# EAGLE design PGTN_daisy1_main_8cvin_2cvout (EAGLE 9.6.0)
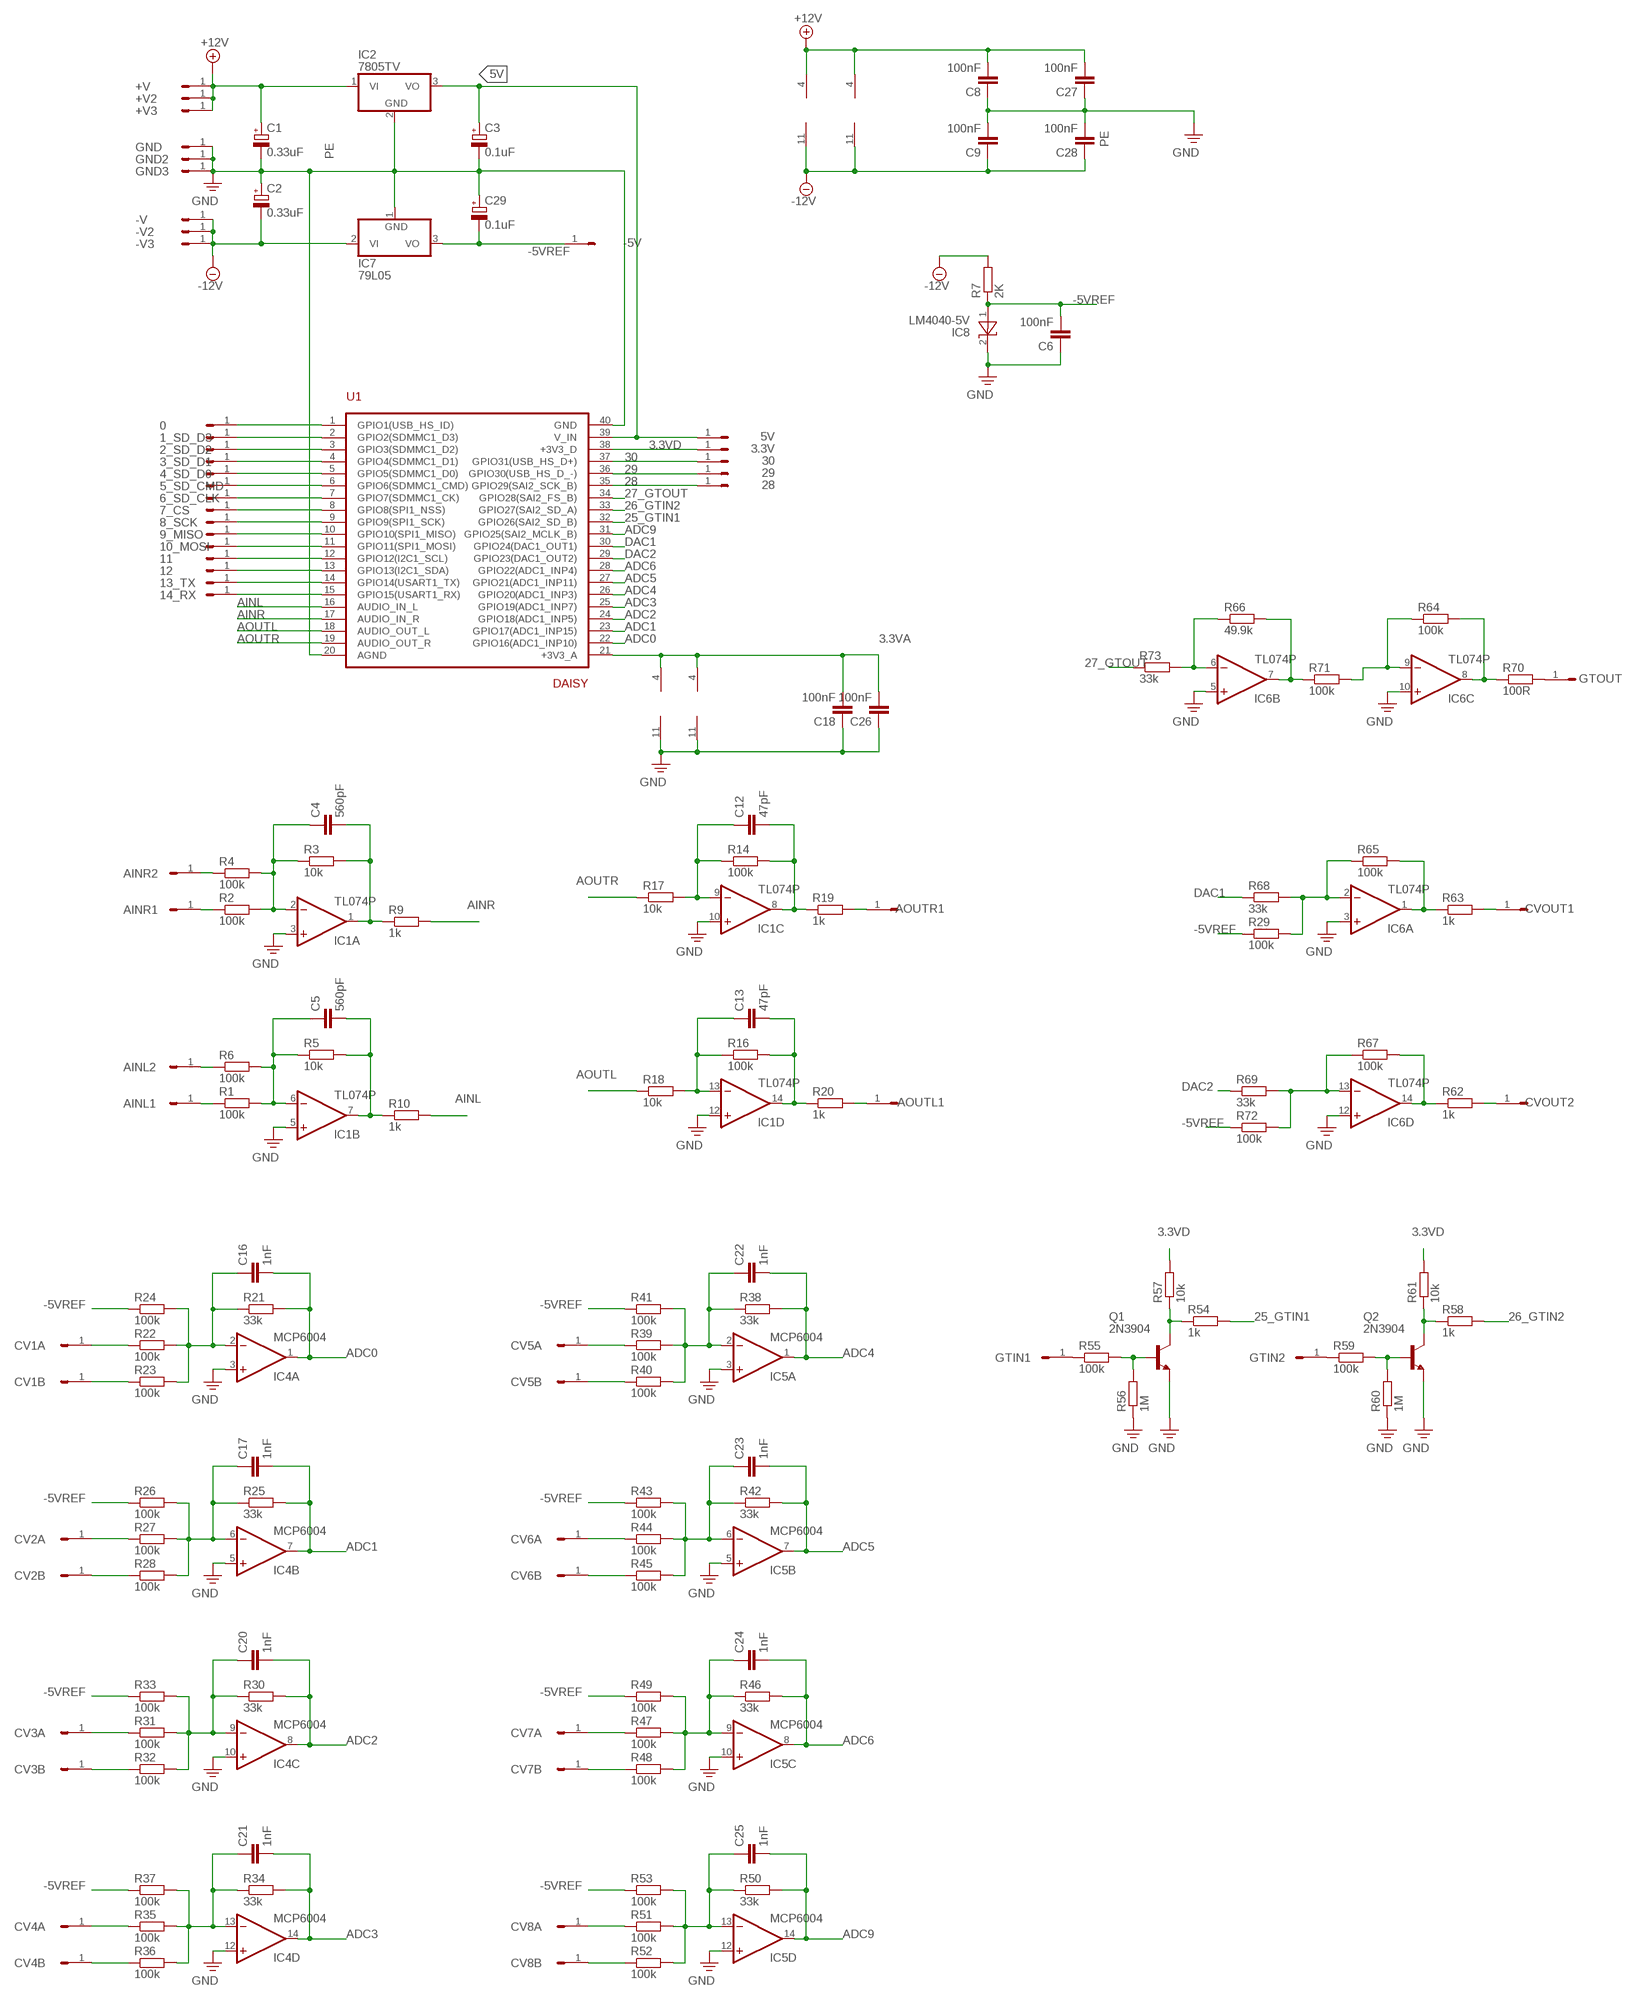
[diagram p0: schematic, sheet 1]

## Parts
0  HEADER/MALE/01  [HEADER/MALE/01]
1_SD_D3  HEADER/MALE/01  [HEADER/MALE/01]
2_SD_D2  HEADER/MALE/01  [HEADER/MALE/01]
3.3V  HEADER/MALE/01  [HEADER/MALE/01]
3_SD_D1  HEADER/MALE/01  [HEADER/MALE/01]
4_SD_D0  HEADER/MALE/01  [HEADER/MALE/01]
5_SD_CMD  HEADER/MALE/01  [HEADER/MALE/01]
5V  HEADER/MALE/01  [HEADER/MALE/01]
6_SD_CLK  HEADER/MALE/01  [HEADER/MALE/01]
7_CS  HEADER/MALE/01  [HEADER/MALE/01]
8_SCK  HEADER/MALE/01  [HEADER/MALE/01]
9_MISO  HEADER/MALE/01  [HEADER/MALE/01]
10_MOSI  HEADER/MALE/01  [HEADER/MALE/01]
11  HEADER/MALE/01  [HEADER/MALE/01]
12  HEADER/MALE/01  [HEADER/MALE/01]
13_TX  HEADER/MALE/01  [HEADER/MALE/01]
14_RX  HEADER/MALE/01  [HEADER/MALE/01]
28  HEADER/MALE/01  [HEADER/MALE/01]
29  HEADER/MALE/01  [HEADER/MALE/01]
30  HEADER/MALE/01  [HEADER/MALE/01]
+V  HEADER/MALE/01  [HEADER/MALE/01]
+V2  HEADER/MALE/01  [HEADER/MALE/01]
+V3  HEADER/MALE/01  [HEADER/MALE/01]
-5V  HEADER/MALE/01  [HEADER/MALE/01]
-V  HEADER/MALE/01  [HEADER/MALE/01]
-V2  HEADER/MALE/01  [HEADER/MALE/01]
-V3  HEADER/MALE/01  [HEADER/MALE/01]
AINL1  HEADER/MALE/01  [HEADER/MALE/01]
AINL2  HEADER/MALE/01  [HEADER/MALE/01]
AINR1  HEADER/MALE/01  [HEADER/MALE/01]
AINR2  HEADER/MALE/01  [HEADER/MALE/01]
AOUTL1  HEADER/MALE/01  [HEADER/MALE/01]
AOUTR1  HEADER/MALE/01  [HEADER/MALE/01]
C1  0.33uF  CAPACITOR/POLARIZEDE2.5-6  [E2,5-6]
C2  0.33uF  CAPACITOR/POLARIZEDE2.5-6  [E2,5-6]
C3  0.1uF  CAPACITOR/POLARIZEDE2.5-6  [E2,5-6]
C4  560pF  CAPACITORCERAMICDISC/5  [CERAMICDISC/5]
C5  560pF  CAPACITORCERAMICDISC/5  [CERAMICDISC/5]
C6  100nF  CAPACITORCERAMICDISC/5  [CERAMICDISC/5]
C8  100nF  CAPACITORCERAMICDISC/5  [CERAMICDISC/5]
C9  100nF  CAPACITORCERAMICDISC/5  [CERAMICDISC/5]
C12  47pF  CAPACITORCERAMICDISC/5  [CERAMICDISC/5]
C13  47pF  CAPACITORCERAMICDISC/5  [CERAMICDISC/5]
C16  1nF  CAPACITORCERAMICDISC/5  [CERAMICDISC/5]
C17  1nF  CAPACITORCERAMICDISC/5  [CERAMICDISC/5]
C18  100nF  CAPACITORCERAMICDISC/5  [CERAMICDISC/5]
C20  1nF  CAPACITORCERAMICDISC/5  [CERAMICDISC/5]
C21  1nF  CAPACITORCERAMICDISC/5  [CERAMICDISC/5]
C22  1nF  CAPACITORCERAMICDISC/5  [CERAMICDISC/5]
C23  1nF  CAPACITORCERAMICDISC/5  [CERAMICDISC/5]
C24  1nF  CAPACITORCERAMICDISC/5  [CERAMICDISC/5]
C25  1nF  CAPACITORCERAMICDISC/5  [CERAMICDISC/5]
C26  100nF  CAPACITORCERAMICDISC/5  [CERAMICDISC/5]
C27  100nF  CAPACITORCERAMICDISC/5  [CERAMICDISC/5]
C28  100nF  CAPACITORCERAMICDISC/5  [CERAMICDISC/5]
C29  0.1uF  CAPACITOR/POLARIZEDE2.5-6  [E2,5-6]
CV1A  HEADER/MALE/01  [HEADER/MALE/01]
CV1B  HEADER/MALE/01  [HEADER/MALE/01]
CV2A  HEADER/MALE/01  [HEADER/MALE/01]
CV2B  HEADER/MALE/01  [HEADER/MALE/01]
CV3A  HEADER/MALE/01  [HEADER/MALE/01]
CV3B  HEADER/MALE/01  [HEADER/MALE/01]
CV4A  HEADER/MALE/01  [HEADER/MALE/01]
CV4B  HEADER/MALE/01  [HEADER/MALE/01]
CV5A  HEADER/MALE/01  [HEADER/MALE/01]
CV5B  HEADER/MALE/01  [HEADER/MALE/01]
CV6A  HEADER/MALE/01  [HEADER/MALE/01]
CV6B  HEADER/MALE/01  [HEADER/MALE/01]
CV7A  HEADER/MALE/01  [HEADER/MALE/01]
CV7B  HEADER/MALE/01  [HEADER/MALE/01]
CV8A  HEADER/MALE/01  [HEADER/MALE/01]
CV8B  HEADER/MALE/01  [HEADER/MALE/01]
CVOUT1  HEADER/MALE/01  [HEADER/MALE/01]
CVOUT2  HEADER/MALE/01  [HEADER/MALE/01]
GND  HEADER/MALE/01  [HEADER/MALE/01]
GND2  HEADER/MALE/01  [HEADER/MALE/01]
GND3  HEADER/MALE/01  [HEADER/MALE/01]
GTIN1  HEADER/MALE/01  [HEADER/MALE/01]
GTIN2  HEADER/MALE/01  [HEADER/MALE/01]
GTOUT  HEADER/MALE/01  [HEADER/MALE/01]
IC1  TL074P  [DIL14]
IC2  7805TV  [TO220V]
IC4  MCP6004  TL074P  [DIL14]
IC5  MCP6004  TL074P  [DIL14]
IC6  TL074P  [DIL14]
IC7  79L05  79L05Z  [TO92]
IC8  LM4040-5V  LM4040  [TO92]
Q1  2N3904  [TO92]
Q2  2N3904  [TO92]
R1  100k  RESISTORRESISTOR/UPRIGHT/7.5  [RESISTOR/7.5]
R2  100k  RESISTORRESISTOR/UPRIGHT/7.5  [RESISTOR/7.5]
R3  10k  RESISTORRESISTOR/UPRIGHT/7.5  [RESISTOR/7.5]
R4  100k  RESISTORRESISTOR/UPRIGHT/7.5  [RESISTOR/7.5]
R5  10k  RESISTORRESISTOR/UPRIGHT/7.5  [RESISTOR/7.5]
R6  100k  RESISTORRESISTOR/UPRIGHT/7.5  [RESISTOR/7.5]
R7  2K  RESISTORRESISTOR/UPRIGHT/7.5  [RESISTOR/7.5]
R9  1k  RESISTORRESISTOR/UPRIGHT/7.5  [RESISTOR/7.5]
R10  1k  RESISTORRESISTOR/UPRIGHT/7.5  [RESISTOR/7.5]
R14  100k  RESISTORRESISTOR/UPRIGHT/7.5  [RESISTOR/7.5]
R16  100k  RESISTORRESISTOR/UPRIGHT/7.5  [RESISTOR/7.5]
R17  10k  RESISTORRESISTOR/UPRIGHT/7.5  [RESISTOR/7.5]
R18  10k  RESISTORRESISTOR/UPRIGHT/7.5  [RESISTOR/7.5]
R19  1k  RESISTORRESISTOR/UPRIGHT/7.5  [RESISTOR/7.5]
R20  1k  RESISTORRESISTOR/UPRIGHT/7.5  [RESISTOR/7.5]
R21  33k  RESISTORRESISTOR/UPRIGHT/7.5  [RESISTOR/7.5]
R22  100k  RESISTORRESISTOR/UPRIGHT/7.5  [RESISTOR/7.5]
R23  100k  RESISTORRESISTOR/UPRIGHT/7.5  [RESISTOR/7.5]
R24  100k  RESISTORRESISTOR/UPRIGHT/7.5  [RESISTOR/7.5]
R25  33k  RESISTORRESISTOR/UPRIGHT/7.5  [RESISTOR/7.5]
R26  100k  RESISTORRESISTOR/UPRIGHT/7.5  [RESISTOR/7.5]
R27  100k  RESISTORRESISTOR/UPRIGHT/7.5  [RESISTOR/7.5]
R28  100k  RESISTORRESISTOR/UPRIGHT/7.5  [RESISTOR/7.5]
R29  100k  RESISTORRESISTOR/UPRIGHT/7.5  [RESISTOR/7.5]
R30  33k  RESISTORRESISTOR/UPRIGHT/7.5  [RESISTOR/7.5]
R31  100k  RESISTORRESISTOR/UPRIGHT/7.5  [RESISTOR/7.5]
R32  100k  RESISTORRESISTOR/UPRIGHT/7.5  [RESISTOR/7.5]
R33  100k  RESISTORRESISTOR/UPRIGHT/7.5  [RESISTOR/7.5]
R34  33k  RESISTORRESISTOR/UPRIGHT/7.5  [RESISTOR/7.5]
R35  100k  RESISTORRESISTOR/UPRIGHT/7.5  [RESISTOR/7.5]
R36  100k  RESISTORRESISTOR/UPRIGHT/7.5  [RESISTOR/7.5]
R37  100k  RESISTORRESISTOR/UPRIGHT/7.5  [RESISTOR/7.5]
R38  33k  RESISTORRESISTOR/UPRIGHT/7.5  [RESISTOR/7.5]
R39  100k  RESISTORRESISTOR/UPRIGHT/7.5  [RESISTOR/7.5]
R40  100k  RESISTORRESISTOR/UPRIGHT/7.5  [RESISTOR/7.5]
R41  100k  RESISTORRESISTOR/UPRIGHT/7.5  [RESISTOR/7.5]
R42  33k  RESISTORRESISTOR/UPRIGHT/7.5  [RESISTOR/7.5]
R43  100k  RESISTORRESISTOR/UPRIGHT/7.5  [RESISTOR/7.5]
R44  100k  RESISTORRESISTOR/UPRIGHT/7.5  [RESISTOR/7.5]
R45  100k  RESISTORRESISTOR/UPRIGHT/7.5  [RESISTOR/7.5]
R46  33k  RESISTORRESISTOR/UPRIGHT/7.5  [RESISTOR/7.5]
R47  100k  RESISTORRESISTOR/UPRIGHT/7.5  [RESISTOR/7.5]
R48  100k  RESISTORRESISTOR/UPRIGHT/7.5  [RESISTOR/7.5]
R49  100k  RESISTORRESISTOR/UPRIGHT/7.5  [RESISTOR/7.5]
R50  33k  RESISTORRESISTOR/UPRIGHT/7.5  [RESISTOR/7.5]
R51  100k  RESISTORRESISTOR/UPRIGHT/7.5  [RESISTOR/7.5]
R52  100k  RESISTORRESISTOR/UPRIGHT/7.5  [RESISTOR/7.5]
R53  100k  RESISTORRESISTOR/UPRIGHT/7.5  [RESISTOR/7.5]
R54  1k  RESISTORRESISTOR/UPRIGHT/7.5  [RESISTOR/7.5]
R55  100k  RESISTORRESISTOR/UPRIGHT/7.5  [RESISTOR/7.5]
R56  1M  RESISTORRESISTOR/UPRIGHT/7.5  [RESISTOR/7.5]
R57  10k  RESISTORRESISTOR/UPRIGHT/7.5  [RESISTOR/7.5]
R58  1k  RESISTORRESISTOR/UPRIGHT/7.5  [RESISTOR/7.5]
R59  100k  RESISTORRESISTOR/UPRIGHT/7.5  [RESISTOR/7.5]
R60  1M  RESISTORRESISTOR/UPRIGHT/7.5  [RESISTOR/7.5]
R61  10k  RESISTORRESISTOR/UPRIGHT/7.5  [RESISTOR/7.5]
R62  1k  RESISTORRESISTOR/UPRIGHT/7.5  [RESISTOR/7.5]
R63  1k  RESISTORRESISTOR/UPRIGHT/7.5  [RESISTOR/7.5]
R64  100k  RESISTORRESISTOR/UPRIGHT/7.5  [RESISTOR/7.5]
R65  100k  RESISTORRESISTOR/UPRIGHT/7.5  [RESISTOR/7.5]
R66  49.9k  RESISTORRESISTOR/UPRIGHT/7.5  [RESISTOR/7.5]
R67  100k  RESISTORRESISTOR/UPRIGHT/7.5  [RESISTOR/7.5]
R68  33k  RESISTORRESISTOR/UPRIGHT/7.5  [RESISTOR/7.5]
R69  33k  RESISTORRESISTOR/UPRIGHT/7.5  [RESISTOR/7.5]
R70  100R  RESISTORRESISTOR/UPRIGHT/7.5  [RESISTOR/7.5]
R71  100k  RESISTORRESISTOR/UPRIGHT/7.5  [RESISTOR/7.5]
R72  100k  RESISTORRESISTOR/UPRIGHT/7.5  [RESISTOR/7.5]
R73  33k  RESISTORRESISTOR/UPRIGHT/7.5  [RESISTOR/7.5]
U1  DAISY  ES_DAISY_SEED_REV4  [ES_DAISY_SEED]

## Nets
3.3VA: C18.2 C26.2 IC4.4(P:V+) IC5.4(P:V+) U1.21(+3V3_A)
3.3VD: 3.3V.1 R57.2 R61.2 U1.38(+3V3_D)
5V: 5V.1 C3.+ IC2.3(VO) U1.39(V_IN)
25_GTIN1: R54.2 U1.32(GPIO26(SAI2_SD_B))
26_GTIN2: R58.2 U1.33(GPIO27(SAI2_SD_A))
27_GTOUT: R73.1 U1.34(GPIO28(SAI2_FS_B))
28: 28.1 U1.35(GPIO29(SAI2_SCK_B))
29: 29.1 U1.36(GPIO30(USB_HS_D_-))
30: 30.1 U1.37(GPIO31(USB_HS_D+))
+12V: +V2.1 +V3.1 +V.1 C1.+ C8.2 C27.2 IC1.4(P:V+) IC2.1(VI) IC6.4(P:V+)
-5VREF: -5V.1 C6.2 C29.- IC7.3(VO) IC8.1(A) R7.1 R24.1 R26.1 R29.1 R33.1 R37.1 R41.1 R43.1 R49.1 R53.1 R72.1
-12V: -V2.1 -V3.1 -V.1 C2.- C9.1 C28.1 IC1.11(P:V-) IC6.11(P:V-) IC7.2(VI) R7.2
ADC0: C16.2 IC4.1(A:OUT) R21.2 U1.22(GPIO16(ADC1_INP10))
ADC1: C17.2 IC4.7(B:OUT) R25.2 U1.23(GPIO17(ADC1_INP15))
ADC2: C20.2 IC4.8(C:OUT) R30.2 U1.24(GPIO18(ADC1_INP5))
ADC3: C21.2 IC4.14(D:OUT) R34.2 U1.25(GPIO19(ADC1_INP7))
ADC4: C22.2 IC5.1(A:OUT) R38.2 U1.26(GPIO20(ADC1_INP3))
ADC5: C23.2 IC5.7(B:OUT) R42.2 U1.27(GPIO21(ADC1_INP11))
ADC6: C24.2 IC5.8(C:OUT) R46.2 U1.28(GPIO22(ADC1_INP4))
ADC9: C25.2 IC5.14(D:OUT) R50.2 U1.31(GPIO25(SAI2_MCLK_B))
AINL: R10.2 U1.16(AUDIO_IN_L)
AINR: R9.2 U1.17(AUDIO_IN_R)
AOUTL: R18.1 U1.18(AUDIO_OUT_L)
AOUTR: R17.1 U1.19(AUDIO_OUT_R)
DAC1: R68.1 U1.30(GPIO24(DAC1_OUT1))
DAC2: R69.1 U1.29(GPIO23(DAC1_OUT2))
N$1: CV2A.1 R27.1
N$2: AINR2.1 R4.1
N$3: AINL2.1 R6.1
N$4: C4.1 IC1.2(A:-IN) R2.2 R3.1 R4.2
N$5: C5.1 IC1.6(B:-IN) R1.2 R5.1 R6.2
N$6: AINR1.1 R2.1
N$7: AINL1.1 R1.1
N$9: C5.2 IC1.7(B:OUT) R5.2 R10.1
N$10: C4.2 IC1.1(A:OUT) R3.2 R9.1
N$11: AOUTR1.1 R19.2
N$12: C12.2 IC1.8(C:OUT) R14.2 R19.1
N$15: C13.2 IC1.14(D:OUT) R16.2 R20.1
N$17: C13.1 IC1.13(D:-IN) R16.1 R18.2
N$20: C12.1 IC1.9(C:-IN) R14.1 R17.2
N$21: AOUTL1.1 R20.2
N$22: CV1A.1 R22.1
N$23: 14_RX.1 U1.15(GPIO15(USART1_RX))
N$24: C16.1 IC4.2(A:-IN) R21.1 R22.2 R23.2 R24.2
N$25: GTIN2.1 R59.1
N$26: CV2B.1 R28.1
N$27: CV1B.1 R23.1
N$28: 13_TX.1 U1.14(GPIO14(USART1_TX))
N$29: C17.1 IC4.6(B:-IN) R25.1 R26.2 R27.2 R28.2
N$30: C21.1 IC4.13(D:-IN) R34.1 R35.2 R36.2 R37.2
N$31: CV4A.1 R35.1
N$32: CV4B.1 R36.1
N$33: 10_MOSI.1 U1.11(GPIO11(SPI1_MOSI))
N$34: CV3B.1 R32.1
N$35: CV3A.1 R31.1
N$36: C20.1 IC4.9(C:-IN) R30.1 R31.2 R32.2 R33.2
N$37: 9_MISO.1 U1.10(GPIO10(SPI1_MISO))
N$38: C22.1 IC5.2(A:-IN) R38.1 R39.2 R40.2 R41.2
N$39: 8_SCK.1 U1.9(GPIO9(SPI1_SCK))
N$40: CV5B.1 R40.1
N$41: CV5A.1 R39.1
N$42: 7_CS.1 U1.8(GPIO8(SPI1_NSS))
N$43: C23.1 IC5.6(B:-IN) R42.1 R43.2 R44.2 R45.2
N$44: CV6A.1 R44.1
N$45: CV6B.1 R45.1
N$46: C25.1 IC5.13(D:-IN) R50.1 R51.2 R52.2 R53.2
N$47: 6_SD_CLK.1 U1.7(GPIO7(SDMMC1_CK))
N$48: CV8A.1 R51.1
N$49: CV8B.1 R52.1
N$50: CV7B.1 R48.1
N$51: CV7A.1 R47.1
N$52: C24.1 IC5.9(C:-IN) R46.1 R47.2 R48.2 R49.2
N$53: 5_SD_CMD.1 U1.6(GPIO6(SDMMC1_CMD))
N$54: GTIN1.1 R55.1
N$55: Q1.2(B) R55.2 R56.2
N$56: Q1.1(C) R54.1 R57.1
N$57: CVOUT1.1 R63.2
N$58: Q2.2(B) R59.2 R60.2
N$59: Q2.1(C) R58.1 R61.1
N$60: CVOUT2.1 R62.2
N$61: 4_SD_D0.1 U1.5(GPIO5(SDMMC1_D0))
N$62: 3_SD_D1.1 U1.4(GPIO4(SDMMC1_D1))
N$63: 2_SD_D2.1 U1.3(GPIO3(SDMMC1_D2))
N$64: 1_SD_D3.1 U1.2(GPIO2(SDMMC1_D3))
N$65: 0.1 U1.1(GPIO1(USB_HS_ID))
N$66: 11.1 U1.12(GPIO12(I2C1_SCL))
N$67: 12.1 U1.13(GPIO13(I2C1_SDA))
N$69: IC6.1(A:OUT) R63.1 R65.2
N$70: IC6.9(C:-IN) R64.1 R71.2
N$71: IC6.14(D:OUT) R62.1 R67.2
N$72: IC6.6(B:-IN) R66.1 R73.2
N$73: IC6.13(D:-IN) R67.1 R69.2 R72.2
N$74: IC6.7(B:OUT) R66.2 R71.1
N$75: IC6.8(C:OUT) R64.2 R70.1
N$76: IC6.2(A:-IN) R29.2 R65.1 R68.2
N$78: GTOUT.1 R70.2
PE: C1.- C2.+ C3.- C6.1 C8.1 C9.2 C18.1 C26.1 C27.1 C28.2 C29.+ GND2.1 GND3.1 GND.1 IC1.3(A:+IN) IC1.5(B:+IN) IC1.10(C:+IN) IC1.12(D:+IN) IC2.2(GND) IC4.3(A:+IN) IC4.5(B:+IN) IC4.10(C:+IN) IC4.11(P:V-) IC4.12(D:+IN) IC5.3(A:+IN) IC5.5(B:+IN) IC5.10(C:+IN) IC5.11(P:V-) IC5.12(D:+IN) IC6.3(A:+IN) IC6.5(B:+IN) IC6.10(C:+IN) IC6.12(D:+IN) IC7.1(GND) IC8.2(C) Q1.3(E) Q2.3(E) R56.1 R60.1 U1.20(AGND) U1.40(GND) ; supply symbol labelled GND

## Library data of the parts
0 1_SD_D3 2_SD_D2 3.3V 3_SD_D1 4_SD_D0 5_SD_CMD 5V 6_SD_CLK 7_CS 8_SCK 9_MISO 10_MOSI 11 12 13_TX 14_RX 28-30 +V +V2 +V3 -5V -V -V2 -V3 AINL1 AINL2 AINR1 AINR2 AOUTL1 AOUTR1 CV1A CV1B CV2A CV2B CV3A CV3B CV4A CV4B CV5A CV5B CV6A CV6B CV7A CV7B CV8A CV8B CVOUT1 CVOUT2 GND GND2 GND3 GTIN1 GTIN2 GTOUT = connectors:HEADER/MALE/01; SPICEPREFIX: X
C1-C3 C29 = capacitors:CAPACITOR/POLARIZED: POLARIZED CAPACITOR, European symbol; SPICEPREFIX: C
C4-C6 C8 C9 C12 C13 C16-C18 C20-C28 = capacitors:CAPACITOR: CAPACITOR, European symbol
IC1 IC4-IC6 = ic_analogue:TL074: OP AMP
IC2 = ic_voltage_reg:78*: Positive VOLTAGE REGULATOR Source: http://cache.national.com/ds/LM/LM78L05.pdf http://www.fairchildsemi.com/ds/LM/LM7805.pdf
IC7 = linear:79*: Negative VOLTAGE REGULATOR
IC8 = ic_voltage_reg:LM4040
Q1 Q2 = transistors:2N3904: NPN Transistor
R1-R7 R9 R10 R14 R16-R73 = resistors:RESISTOR: RESISTOR, European symbol
U1 = Electrosmith-Boards:ES_DAISY_SEED_REV4; IPN: Daisy Seed

## Board
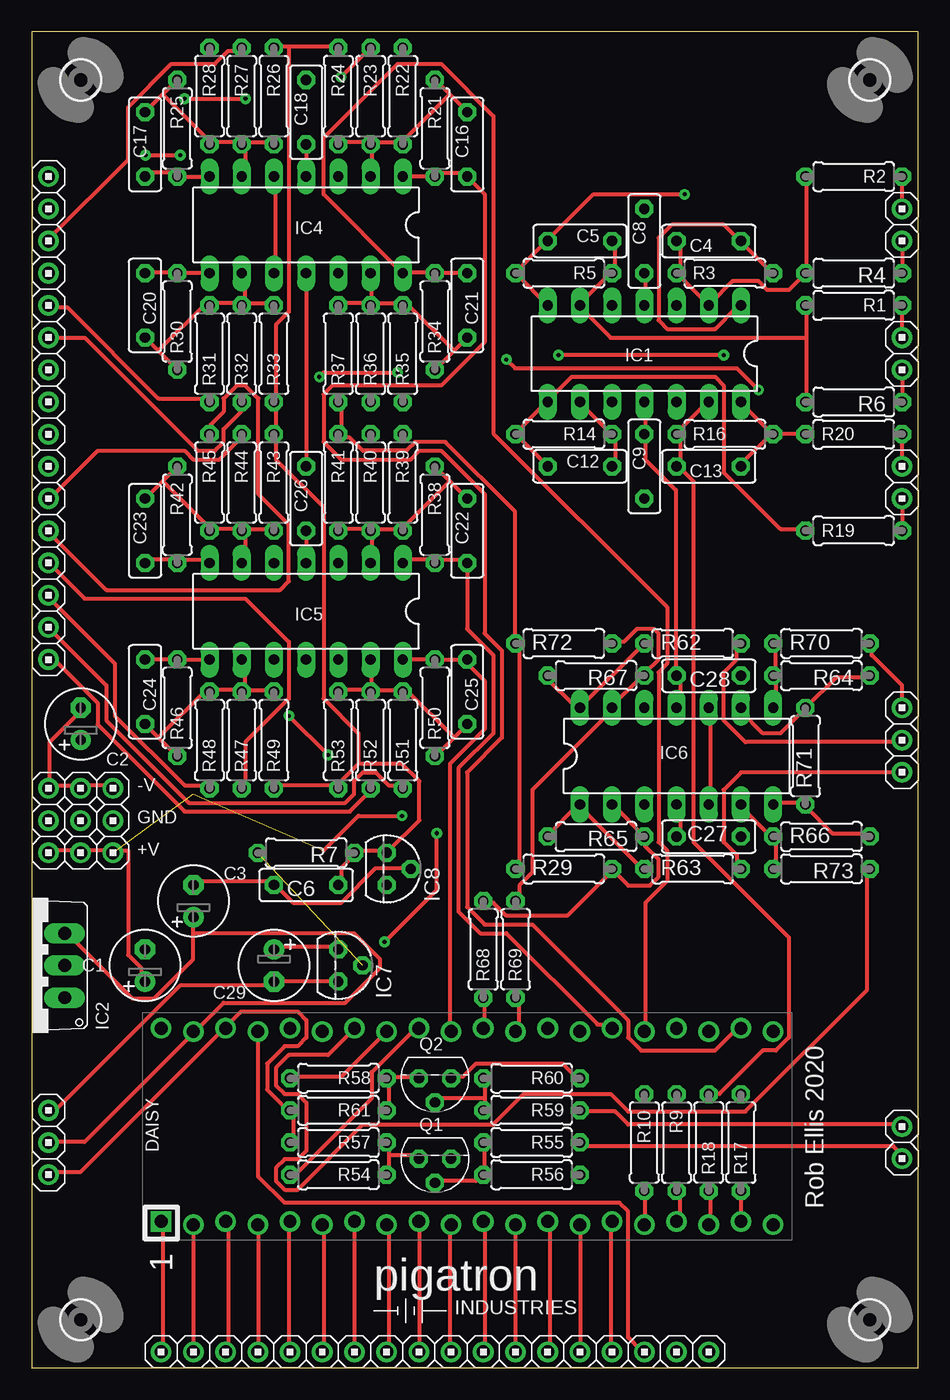
[diagram p1: board, top side]
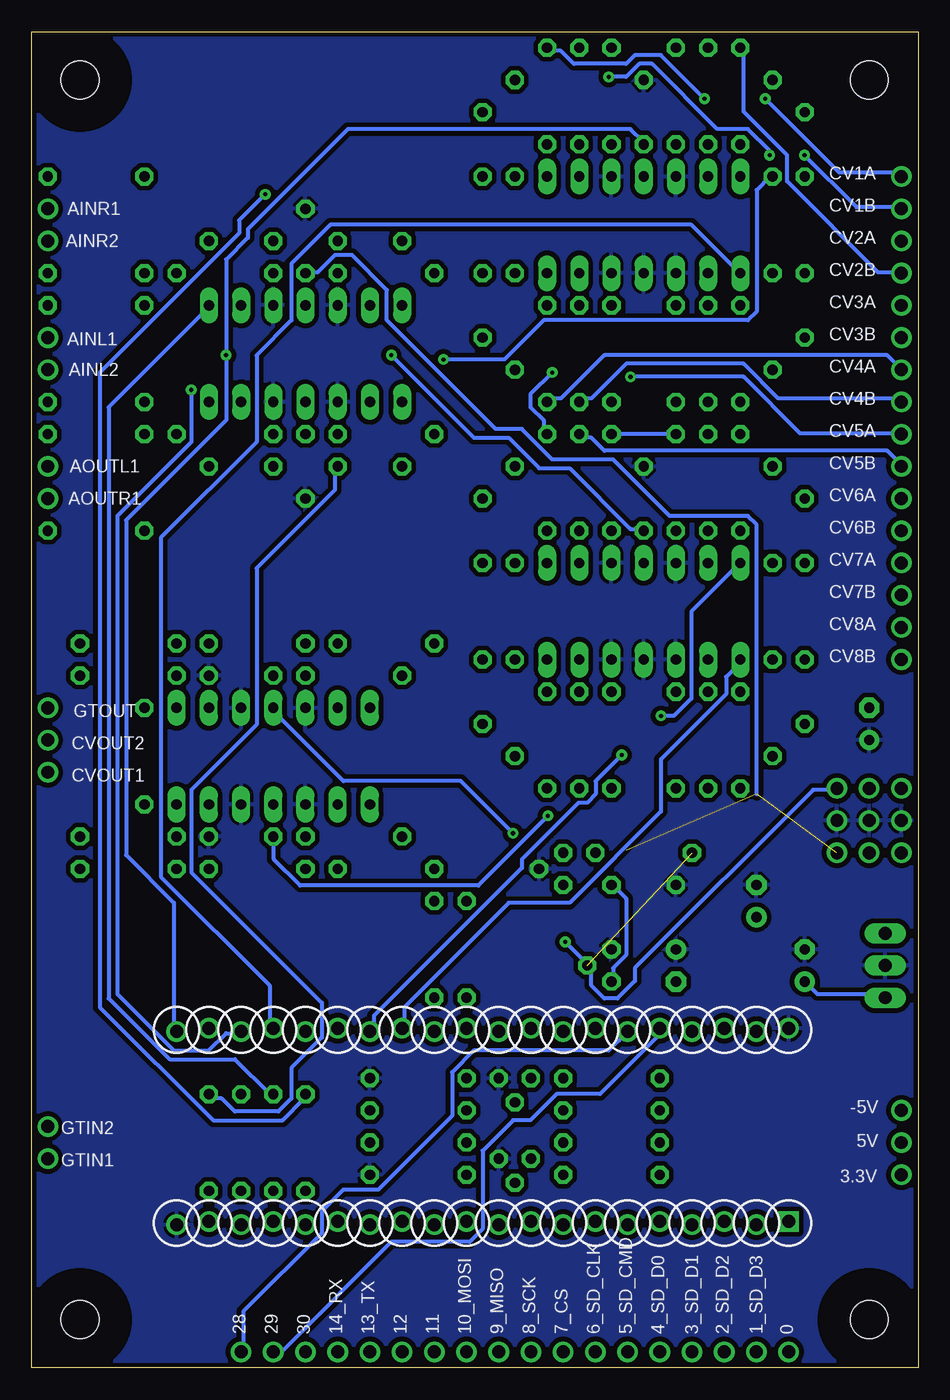
[diagram p2: board, bottom side, seen from below]

Size 69.9 x 105.4 mm. Coordinates in mm from the lower left corner, seen from the top.
Outline: 69.9,105.4 0,105.4 0,0 69.9,0 69.9,105.4
Copper layers (1*16): Top 0.0356mm / dielectric 1.5011mm / Bottom 0.0356mm
Design rules "pigatron": minimum track width 12mil, minimum drill 13mil, track to track 15mil, track to pad 10mil, pad to pad 10mil, via to via 10mil, smd to smd 6mil, copper to edge 15mil, drill to drill 10mil, minimum pad ring 12mil, minimum via ring 10mil, stop-mask expansion 4mil, vias tented up to drill 0mil, thermal gap 10mil

### Footprints (pad centres in the part's own frame; a part is rotated, then mirrored left to right if it is on the bottom)
HEADER/MALE/01 = drill 1.016: 1 0,0
E2,5-6 = drill 0.813 pad 1.6: + -1.27,0 | drill 0.813 pad 1.6 octagon: - 1.27,0
CERAMICDISC/5 = drill 0.813 octagon: 1 -2.54,0; 2 2.54,0
DIL14 = drill 0.813 long: 1 -7.62,-3.81; 2 -5.08,-3.81; 3 -2.54,-3.81; 4 0,-3.81; 5 2.54,-3.81; 6 5.08,-3.81; 7 7.62,-3.81; 8 7.62,3.81; 9 5.08,3.81; 10 2.54,3.81; 11 0,3.81; 12 -2.54,3.81; 13 -5.08,3.81; 14 -7.62,3.81
TO220V = drill 1.016 long: 1 -2.54,-2.54; 2 0,-2.54; 3 2.54,-2.54
TO92 = drill 0.813 octagon: 1 -1.27,0; 2 0,1.905; 3 1.27,0
TO92' = drill 0.813 octagon: 1 1.27,0; 2 0,1.905; 3 -1.27,0
RESISTOR/7.5 = drill 0.813 octagon: 1 -3.81,0; 2 3.81,0
ES_DAISY_SEED = drill 1.016 square: 1 -7.493,24.13 | drill 1.016: 2 -7.747,21.59; 3 -7.493,19.05; 4 -7.747,16.51; 5 -7.493,13.97; 6 -7.747,11.43; 7 -7.493,8.89; 8 -7.747,6.35; 9 -7.493,3.81; 10 -7.747,1.27; 11 -7.493,-1.27; 12 -7.747,-3.81; 13 -7.493,-6.35; 14 -7.747,-8.89; 15 -7.493,-11.43; 16 -7.747,-13.97; 17 -7.493,-16.51; 18 -7.747,-19.05; 19 -7.493,-21.59; 20 -7.747,-24.13; 21 7.493,-24.13; 22 7.747,-21.59; 23 7.493,-19.05; 24 7.747,-16.51; 25 7.493,-13.97; 26 7.747,-11.43; 27 7.493,-8.89; 28 7.747,-6.35; 29 7.493,-3.81; 30 7.747,-1.27; 31 7.493,1.27; 32 7.747,3.81; 33 7.493,6.35; 34 7.747,8.89; 35 7.493,11.43; 36 7.747,13.97; 37 7.493,16.51; 38 7.747,19.05; 39 7.493,21.59; 40 7.747,24.13
STANDOFF/3.0 = hole 3: 0,0

### Placement (x,y rotation side)
0  10.21,1.26 90 top
1_SD_D3  12.75,1.26 90 top
2_SD_D2  15.29,1.26 90 top
3.3V  1.32,15.23 270 top
3_SD_D1  17.83,1.26 90 top
4_SD_D0  20.37,1.26 90 top
5_SD_CMD  22.91,1.26 90 top
5V  1.32,17.77 180 top
6_SD_CLK  25.45,1.26 90 top
7_CS  27.99,1.26 90 top
8_SCK  30.53,1.26 90 top
9_MISO  33.07,1.26 90 top
10_MOSI  35.61,1.26 90 top
11  38.15,1.26 90 top
12  40.69,1.26 90 top
13_TX  43.23,1.26 90 top
14_RX  45.77,1.26 90 top
28  53.39,1.26 90 top
29  50.85,1.26 90 top
30  48.31,1.26 90 top
+V  6.4,40.63 0 top
+V2  3.86,40.63 180 top
+V3  1.32,40.63 180 top
-5V  1.32,20.31 0 top
-V  6.4,45.71 0 top
-V2  3.86,45.71 180 top
-V3  1.32,45.71 180 top
AINL1  68.63,81.27 180 top
AINL2  68.63,78.73 180 top
AINR1  68.63,91.43 180 top
AINR2  68.63,88.89 180 top
AOUTL1  68.63,71.11 180 top
AOUTR1  68.63,68.57 180 top
C1  8.94,31.74 90 top
C2  3.86,50.79 90 top
C3  12.75,36.82 90 top
C4  53.39,88.89 0 top
C5  43.23,88.89 180 top
C6  21.64,38.09 0 top
C8  48.31,88.89 270 top
C9  48.31,71.11 270 top
C12  43.23,71.11 180 top
C13  53.39,71.11 0 top
C16  34.34,96.51 270 top
C17  8.94,96.51 270 top
C18  21.64,99.05 270 top
C20  8.94,83.81 90 top
C21  34.34,83.81 90 top
C22  34.34,66.03 270 top
C23  8.94,66.03 270 top
C24  8.94,53.33 90 top
C25  34.34,53.33 90 top
C26  21.64,68.57 270 top
C27  53.39,41.9 180 top
C28  53.39,54.6 0 top
C29  19.1,31.74 270 top
CV1A  1.32,93.97 0 top
CV1B  1.32,91.43 0 top
CV2A  1.32,88.89 0 top
CV2B  1.32,86.35 0 top
CV3A  1.32,83.81 0 top
CV3B  1.32,81.27 0 top
CV4A  1.32,78.73 0 top
CV4B  1.32,76.19 0 top
CV5A  1.32,73.65 0 top
CV5B  1.32,71.11 0 top
CV6A  1.32,68.57 0 top
CV6B  1.32,66.03 0 top
CV7A  1.32,63.49 0 top
CV7B  1.32,60.95 0 top
CV8A  1.32,58.41 0 top
CV8B  1.32,55.87 0 top
CVOUT1  68.63,46.98 180 top
CVOUT2  68.63,49.52 180 top
GND  6.4,43.17 0 top
GND2  1.32,43.17 180 top
GND3  3.86,43.17 180 top
GTIN1  68.63,16.5 180 top
GTIN2  68.63,19.04 180 top
GTOUT  68.63,52.06 180 top
IC1  48.31,80 180 top
IC2  0.05,31.74 90 top
IC4  21.64,90.16 180 top
IC5  21.64,59.68 180 top
IC6  50.85,48.25 0 top
IC7  24.18,31.74 270 top
IC8  27.99,39.36 270 top
Q1  2N3904  [TO92']  31.8,16.5 180 top
Q2  2N3904  [TO92']  31.8,22.85 180 top
R1  64.82,83.81 180 top
R2  64.82,93.97 180 top
R3  54.66,86.35 0 top
R4  64.82,86.35 180 top
R5  41.96,86.35 180 top
R6  64.82,76.19 180 top
R7  21.64,40.63 180 top
R9  50.85,17.77 270 top
R10  48.31,17.77 270 top
R14  41.96,73.65 180 top
R16  54.66,73.65 0 top
R17  55.93,17.77 90 top
R18  53.39,17.77 90 top
R19  64.82,66.03 0 top
R20  64.82,73.65 0 top
R21  31.8,97.78 270 top
R22  29.26,100.32 270 top
R23  26.72,100.32 270 top
R24  24.18,100.32 270 top
R25  11.48,97.78 270 top
R26  19.1,100.32 270 top
R27  16.56,100.32 270 top
R28  14.02,100.32 270 top
R29  41.96,39.36 0 top
R30  11.48,82.54 90 top
R31  14.02,80 90 top
R32  16.56,80 90 top
R33  19.1,80 90 top
R34  31.8,82.54 90 top
R35  29.26,80 90 top
R36  26.72,80 90 top
R37  24.18,80 90 top
R38  31.8,67.3 270 top
R39  29.26,69.84 270 top
R40  26.72,69.84 270 top
R41  24.18,69.84 270 top
R42  11.48,67.3 270 top
R43  19.1,69.84 270 top
R44  16.56,69.84 270 top
R45  14.02,69.84 270 top
R46  11.48,52.06 90 top
R47  16.56,49.52 90 top
R48  14.02,49.52 90 top
R49  19.1,49.52 90 top
R50  31.8,52.06 90 top
R51  29.26,49.52 90 top
R52  26.72,49.52 90 top
R53  24.18,49.52 90 top
R54  24.18,15.23 180 top
R55  39.42,17.77 180 top
R56  39.42,15.23 180 top
R57  24.18,17.77 180 top
R58  24.18,22.85 180 top
R59  39.42,20.31 180 top
R60  39.42,22.85 180 top
R61  24.18,20.31 180 top
R62  52.12,57.14 0 top
R63  52.12,39.36 0 top
R64  62.28,54.6 180 top
R65  44.5,41.9 180 top
R66  62.28,41.9 0 top
R67  44.5,54.6 180 top
R68  35.61,33.01 90 top
R69  38.15,33.01 90 top
R70  62.28,57.14 0 top
R71  61.01,48.25 90 top
R72  41.96,57.14 0 top
R73  62.28,39.36 180 top
U1  34.34,19.04 90 top
U$1  [PIGATRON-LOGO]  35.87,6.09 0 top
U$2  [STANDOFF/3.0]  66.09,3.8 180 top
U$3  [STANDOFF/3.0]  3.86,3.8 180 top
U$4  [STANDOFF/3.0]  3.86,101.59 0 top
U$7  [STANDOFF/3.0]  66.09,101.59 0 top

### Tracks (layer width: path | path; a pad name or v marks a point on that pad's centre or on a via)
3.3VA  (via drill 0.33)
  Top 0.305: IC5.4 21.65,63.77 21.65,65.83 C26.2 | IC4.4 21.65,94.29 21.65,96.34 C18.2 | v54.57,79.89 v41.54,79.89
  Bottom 0.305: U1.21 58.69,26.74 58.69,36.68 62.46,40.45 62.46,66.85 54.57,74.74 v54.57,79.89 54.57,87.43 52.86,89.14 52.86,89.83 44.97,97.72 22.68,97.72 21.65,96.69 C18.2 | v41.54,79.89 35.03,73.37 32.28,73.37 29.88,70.97 27.48,70.97 22.68,66.17 21.65,66.17 C26.2
3.3VD
  Top 0.305: R57.2 20.62,17.82 20.62,20.22 R61.2 20.28,20.56 19.94,20.56 18.57,21.94 18.57,23.99 19.94,25.36 20.97,25.36 21.65,26.05 21.65,27.42 20.97,28.11 16.51,28.11 15.48,27.08 U1.38 15.14,26.74 3.82,15.42 1.42,15.42 3.3V.1
5V
  Top 0.305: 12.74,34.28 12.74,32.22 9.65,29.14 7.94,29.14 2.79,34.28 IC2.3 | 12.74,34.28 12.74,35.31 C3.+ | 5V.1 1.42,17.82 4.17,17.82 12.74,26.39 U1.39 13.08,26.74 15.14,28.79 24.74,28.79 27.48,31.54 27.48,32.22 25.43,34.28 12.74,34.28
25_GTIN1
  Top 0.305: R54.2 20.62,15.42 20.97,15.42 26.8,21.25 26.8,23.31 30.23,26.74 U1.32
26_GTIN2
  Top 0.305: R58.2 20.62,22.96 24.4,22.96 27.83,26.39 U1.33
27_GTOUT
  Top 0.305: R73.1 65.89,39.08 65.89,29.82 56.29,20.22 47.03,20.22 45.66,21.59 38.8,21.59 36.4,19.19 26.11,19.19 20.97,14.05 19.94,14.05 19.25,14.73 19.25,15.76 19.94,16.45 20.97,16.45 21.65,17.13 21.65,20.91 20.97,21.59 19.94,21.59 19.25,22.28 19.25,23.65 20.28,24.68 23.37,24.68 25.43,26.74 U1.34
28
  Bottom 0.305: 28.1 53.2,1.36 53.2,4.45 47.03,10.62 47.03,12.33 45.31,14.05 42.57,14.05 36.74,19.88 36.74,23.31 35.03,25.02 24.4,25.02 23.02,26.39 U1.35
29
  Bottom 0.305: 29.1 50.8,1.36 50.11,1.36 41.54,9.93 35.37,9.93 34.34,10.96 34.34,17.13 31.94,19.54 30.57,19.54 28.51,21.59 25.08,21.59 20.62,26.05 20.62,26.74 U1.36
30
  Top 0.305: U1.37 17.88,26.39 17.88,15.08 19.94,13.02 46.34,13.02 47.03,12.33 47.03,2.39 48.06,1.36 30.1
+12V  (via drill 0.33)  (2 unrouted)
  Top 0.305: C27.2 51.14,42.17 51.14,44.22 IC6.4 | IC1.4 48.4,84 48.4,86.06 C8.2 | +V3.1 1.42,40.8 3.82,40.8 +V2.1 4.17,40.8 6.22,40.8 +V.1 6.57,40.8 7.59,40.8 7.59,32.57 8.62,31.54 8.62,30.51 C1.+ | v29.2,43.54 25.77,43.54 23.02,40.8
  Bottom 0.305: IC2.1 2.79,29.48 7.94,29.48 8.62,30.16 C1.+ | 12.74,45.25 12.74,66.51 13.42,67.2 19.6,67.2 24.05,71.66 28.85,71.66 31.25,74.06 33.31,74.06 41.89,82.63 41.89,85.03 44.63,87.77 46,87.77 47.37,86.4 48.06,86.4 C8.2 | v29.2,43.54 34.68,38.05 48.74,38.05 50.8,40.11 50.8,41.82 C27.2
-5VREF
  Top 0.305: R49.1 19.25,45.94 24.05,45.94 R53.1 24.4,45.94 24.4,46.28 25.77,47.65 | C6.2 24.4,38.4 24.4,39.42 25.43,40.45 R7.1 25.77,40.8 27.83,40.8 IC8.1 28.17,40.8 30.57,43.2 30.57,46.28 29.2,47.65 25.77,47.65 | 20.28,104.23 24.05,104.23 R24.1 | 20.28,104.23 19.25,104.23 R26.1 | 20.28,104.23 20.28,83.31 19.25,82.29 19.25,76.46 R33.1 19.25,76.11 19.25,73.71 R43.1 19.25,73.37 19.25,71.66 23.02,67.88 23.02,52.8 25.77,50.05 25.77,47.65 | R37.1 24.4,76.11 24.4,73.71 R41.1 24.4,73.37 25.08,73.37 26.11,72.34 29.54,72.34 30.23,73.03 32.63,73.03 38.11,67.54 38.11,57.25 R72.1 38.46,56.91 38.46,39.42 R29.1 | IC7.3 24.05,30.51 19.25,30.51 C29.- 18.91,30.16 11.71,30.16 2.11,20.56 1.42,20.56 -5V.1
  Bottom 0.305: IC7.3 24.05,30.51 24.05,31.54 23.02,32.57 23.02,37.02 24.05,38.05 C6.2 | R43.1 19.25,73.71 24.05,73.71 R41.1
-12V  (via drill 0.33)  (1 unrouted)
  Top 0.305: IC6.11 51.14,52.11 51.14,54.51 C28.1 50.8,54.85 50.8,69.26 48.4,71.66 48.4,73.37 C9.1 48.4,73.71 48.4,76.11 IC1.11 | -V.1 6.22,45.94 4.17,45.94 -V2.1 3.82,45.94 1.42,45.94 | 1.42,45.94 1.42,49.37 3.82,51.77 C2.- | 1.42,45.94 -V3.1 | v31.94,42.17 31.94,37.71 v27.83,33.59
  Bottom 0.305: -V.1 6.57,45.6 8.28,45.6 22.34,31.54 22.34,30.51 23.71,29.14 24.74,29.14 25.77,30.16 25.77,31.54 IC7.2 26.11,31.88 v27.83,33.59 | v31.94,42.17 36.06,46.28 45.31,46.28 50.8,51.77 IC6.11
ADC0
  Top 0.305: IC4.1 29.54,93.94 31.6,93.94 R21.2 31.94,94.29 34.34,94.29 C16.2 34.34,93.94 35.71,92.57 35.71,80.91 32.28,77.48 23.71,77.48 23.02,76.8 23.02,73.03 24.4,71.66 29.88,71.66 30.57,72.34 32.28,72.34 35.71,68.91 35.71,57.94 37.08,56.57 37.08,49.71 34.34,46.97 34.34,36.34 35.71,34.97 39.48,34.97 47.03,27.42 47.03,26.05 48.06,25.02 53.89,25.02 55.6,26.74 U1.22
ADC1  (via drill 0.33)
  Top 0.305: C17.2 8.97,94.29 11.37,94.29 R25.2 11.71,93.94 13.77,93.94 IC4.7 | v57.32,77.14 55.6,78.86 38.11,78.86 v37.43,79.54
  Bottom 0.305: v57.32,77.14 57.32,73.03 63.15,67.2 63.15,29.48 58.69,25.02 55.94,25.02 54.57,26.39 53.54,26.39 U1.23 | v37.43,79.54 32.63,79.54 29.54,82.63 13.42,82.63 12.74,83.31 12.74,92.92 11.71,93.94 R25.2
ADC2
  Top 0.305: C20.2 8.97,86.4 11.37,86.4 R30.2 11.71,86.4 13.77,86.4 IC4.8
  Bottom 0.305: U1.24 51.14,27.08 51.14,30.16 59.72,38.74 59.72,65.48 52.17,73.03 52.17,79.89 49.43,82.63 49.43,87.09 46.34,90.17 17.88,90.17 14.11,86.4 IC4.8
ADC3
  Top 0.305: C21.2 34.34,86.4 31.94,86.4 R34.2 31.6,86.4 29.54,86.4 IC4.14 29.2,86.4 23.02,92.57 23.02,97.03 28.85,102.86 32.28,102.86 36.4,98.74 36.4,73.71 50.11,60 50.11,55.54 49.43,54.85 49.43,41.48 50.11,40.8 50.11,38.4 48.4,36.68 48.4,26.74 U1.25
ADC4
  Top 0.305: IC5.1 29.54,63.77 31.6,63.77 R38.2 31.94,63.77 34.34,63.77 C22.2 34.34,58.28 36.4,56.23 36.4,50.05 33.66,47.31 33.66,36 35.37,34.28 37.43,34.28 44.63,27.08 45.66,27.08 U1.26
ADC5  (via drill 0.33)
  Top 0.305: C23.2 8.97,63.77 11.37,63.77 R42.2 11.71,63.77 13.77,63.77 IC5.7 | v20.28,51.43 v23.37,48.34
  Bottom 0.305: v23.37,48.34 25.43,46.28 25.43,45.25 26.11,44.57 26.8,44.57 31.25,40.11 31.25,39.42 42.91,27.76 42.91,26.74 U1.27 | v20.28,51.43 19.25,51.43 17.88,52.8 17.88,59.66 14.11,63.43 IC5.7
ADC6
  Top 0.305: C24.2 8.97,55.88 11.37,55.88 R46.2 11.71,55.88 13.77,55.88 IC5.8
  Bottom 0.305: U1.28 40.51,27.08 40.51,28.45 32.28,36.68 27.48,36.68 20.28,43.88 20.28,48 15.14,53.14 15.14,54.51 14.11,55.54 IC5.8
ADC9
  Top 0.305: IC5.14 29.54,55.88 31.6,55.88 R50.2 31.94,55.88 34.34,55.88 C25.2 34.34,55.54 35.71,54.17 35.71,50.4 32.97,47.65 32.97,26.74 U1.31
AINL
  Top 0.305: R10.2 48.4,13.71 48.4,11.31 U1.16
AINR
  Top 0.305: R9.2 51.14,13.71 51.14,11.65 U1.17
AOUTL
  Top 0.305: R18.1 53.54,13.71 53.54,11.31 U1.18
AOUTR
  Top 0.305: R17.1 55.94,13.71 55.94,11.65 U1.19
DAC1
  Top 0.305: R68.1 35.71,29.14 35.71,27.08 U1.30
DAC2
  Top 0.305: R69.1 38.46,29.14 38.46,26.74 U1.29
N$1
  Top 0.305: R27.1 16.51,103.89 15.48,103.89 14.45,102.86 11.02,102.86 7.59,99.43 7.59,95.32 1.42,89.14 CV2A.1
N$2
  Top 0.305: AINR2.1 R4.1
N$3
  Top 0.305: AINL2.1 R6.1
N$4
  Top 0.305: C4.1 51.14,88.8 51.14,86.4 R3.1 IC1.2 53.54,84 55.26,85.71 57.32,85.71 58,85.03 59.72,85.03 60.74,86.06 R4.2 61.09,86.4 61.09,93.94 R2.2
N$5
  Top 0.305: 61.09,81.26 61.09,83.66 R1.2 | 61.09,81.26 61.09,76.46 R6.2 | C5.1 46,88.8 46,86.4 R5.1 45.66,86.4 43.26,84 IC1.6 43.26,83.66 45.66,81.26 61.09,81.26
N$6
  Top 0.305: AINR1.1 R2.1
N$7
  Top 0.305: AINL1.1 R1.1
N$9  (via drill 0.33)
  Top 0.305: IC1.7 40.51,84 38.46,86.06 R5.2 38.11,86.4 40.51,88.8 C5.2 40.86,89.14 44.29,92.57 v51.49,92.57
  Bottom 0.305: v51.49,92.57 53.54,90.52 53.54,89.49 64.52,78.51 64.52,28.45 55.6,19.54 50.11,19.54 48.4,21.25 R10.1
N$10
  Top 0.305: IC1.1 55.6,83.66 53.89,81.94 50.11,81.94 49.43,82.63 49.43,89.14 50.46,90.17 54.57,90.17 55.6,89.14 C4.2 55.94,88.8 58.34,86.4 R3.2
  Bottom 0.305: R9.1 51.14,21.59 53.89,24.34 59.03,24.34 63.83,29.14 63.83,75.77 55.94,83.66 IC1.1
N$11
  Top 0.305: AOUTR1.1 R19.2
N$12
  Top 0.305: C12.2 40.51,71.31 38.46,73.37 R14.2 38.11,73.71 40.51,76.11 IC1.8 40.86,76.46 42.57,78.17 53.89,78.17 54.57,77.48 54.57,70.63 59.03,66.17 60.74,66.17 R19.1
N$15
  Top 0.305: 58.34,73.71 55.94,71.31 C13.2 | R20.1 60.74,73.71 58.69,73.71 R16.2 58.34,73.71 | 58.34,73.71 55.94,76.11 IC1.14
N$17
  Top 0.305: R18.2 53.54,21.59 54.23,21.59 57.66,25.02 58.69,25.02 59.72,26.05 59.72,33.94 52.17,41.48 52.17,69.94 51.14,70.97 C13.1 51.14,71.31 51.14,73.37 R16.1 50.8,73.71 53.2,76.11 IC1.13
N$20
  Top 0.305: C12.1 46,71.31 46,73.37 R14.1 45.66,73.71 43.26,76.11 IC1.9
  Bottom 0.305: R17.2 55.6,21.25 54.91,21.25 53.89,20.22 50.46,20.22 49.43,21.25 49.43,23.65 47.03,26.05 47.03,28.79 57.32,39.08 57.32,45.6 52.17,50.74 52.17,63.08 46,69.26 46,70.97 C12.1
N$21
  Top 0.305: AOUTL1.1 R20.2
N$22  (via drill 0.33)
  Top 0.305: v12.05,100.12 v16.85,100.12
  Bottom 0.305: v16.85,100.12 20.28,103.55 22.34,103.55 23.02,102.86 27.14,102.86 28.17,103.89 29.2,103.89 R22.1 | v12.05,100.12 6.22,94.29 1.42,94.29 CV1A.1
N$23
  Top 0.305: 14_RX.1 45.66,1.36 45.66,11.31 U1.15
N$24
  Top 0.305: 32.97,100.46 34.34,99.09 C16.1 | 32.97,100.46 31.94,101.49 R21.1 | R24.2 24.4,96.69 26.45,96.69 R23.2 | IC4.2 26.8,94.29 26.8,96.34 R23.2 | 29.2,96.69 26.8,96.69 R23.2 | 29.2,96.69 32.97,100.46 | 29.2,96.69 R22.2
N$25
  Top 0.305: R59.1 43.26,20.22 46,20.22 47.03,19.19 68.63,19.19 GTIN2.1
N$26
  Bottom 0.305: R28.1 13.77,103.89 13.77,99.09 10.34,95.66 10.34,93.6 3.14,86.4 1.42,86.4 CV2B.1
N$27  (via drill 0.33)
  Top 0.305: v24.4,101.83 26.45,103.89 R23.1 | v8.97,95.66 v11.71,95.66
  Bottom 0.305: v24.4,101.83 23.02,101.83 22,102.86 20.97,102.86 15.82,97.72 13.42,97.72 11.71,96 v11.71,95.66 | v8.97,95.66 4.85,91.54 1.42,91.54 CV1B.1
N$28
  Top 0.305: 13_TX.1 43.26,1.36 43.26,10.96 U1.14
N$29
  Top 0.305: 10.34,100.46 11.37,101.49 R25.1 | 10.34,100.46 8.97,99.09 C17.1 | 14.11,96.69 16.51,96.69 R27.2 | IC4.6 16.85,94.29 16.85,96.34 R27.2 | R26.2 18.91,96.69 16.85,96.69 R27.2 | 14.11,96.69 10.34,100.46 | 14.11,96.69 R28.2
N$30
  Top 0.305: 33.31,80.23 34.34,81.26 C21.1 | 33.31,80.23 31.94,78.86 R34.1 | R37.2 24.4,84 26.45,84 R36.2 26.8,84 | 26.8,84 29.2,84 R35.2 29.54,84 33.31,80.23 | 26.8,84 26.8,86.06 IC4.13
N$31
  Bottom 0.305: R35.1 29.2,76.46 28.17,76.46 24.74,79.89 2.45,79.89 1.42,78.86 CV4A.1
N$32
  Bottom 0.305: R36.1 26.45,76.46 25.77,76.46 23.02,79.2 13.77,79.2 11.02,76.46 1.42,76.46 CV4B.1
N$33
  Top 0.305: 10_MOSI.1 35.71,1.36 35.71,11.31 U1.11
N$34
  Top 0.305: R32.1 16.51,76.11 16.51,75.43 15.14,74.06 15.14,73.03 14.45,72.34 13.08,72.34 4.17,81.26 1.42,81.26 CV3B.1
N$35
  Top 0.305: R31.1 13.77,76.46 10,76.46 2.79,83.66 1.42,83.66 CV3A.1
N$36
  Top 0.305: 10,80.23 11.37,78.86 R30.1 | 10,80.23 8.97,81.26 C20.1 | 16.85,84 16.85,86.06 IC4.9 | 16.85,84 18.91,84 R33.2 | 16.85,84 R32.2 16.51,84 14.11,84 R31.2 13.77,84 10,80.23
N$37
  Top 0.305: 9_MISO.1 32.97,1.36 32.97,10.96 U1.10
N$38
  Top 0.305: C22.1 32.97,69.94 | 32.97,69.94 R38.1 | R41.2 24.4,66.17 26.45,66.17 R40.2 | IC5.2 26.8,63.77 26.8,65.83 R40.2 | 29.2,66.17 26.8,66.17 R40.2 | 29.2,66.17 32.97,69.94 | 29.2,66.17 R39.2
N$39
  Top 0.305: 8_SCK.1 30.57,1.36 30.57,11.31 U1.9
N$40
  Bottom 0.305: R40.1 26.45,73.37 25.77,73.37 24.74,72.34 2.45,72.34 1.42,71.31 CV5B.1
N$41  (via drill 0.33)
  Top 0.305: v28.85,78.51 23.02,78.51 v22.68,78.17
  Bottom 0.305: v28.85,78.51 30.57,76.8 30.57,75.77 29.54,74.74 29.54,73.71 R39.1 | v22.68,78.17 13.77,78.17 9.31,73.71 1.42,73.71 CV5A.1
N$42
  Top 0.305: 7_CS.1 28.17,1.36 28.17,10.96 U1.8
N$43
  Top 0.305: 10.34,69.94 11.37,70.97 R42.1 | 10.34,69.94 8.97,68.57 C23.1 | 14.11,66.17 16.51,66.17 R44.2 | IC5.6 16.85,63.77 16.85,65.83 R44.2 | R43.2 18.91,66.17 16.85,66.17 R44.2 | 14.11,66.17 10.34,69.94 | 14.11,66.17 R45.2
N$44
  Top 0.305: R44.1 16.51,73.37 14.8,71.66 12.74,71.66 12.05,72.34 5.2,72.34 1.42,68.57 CV6A.1
N$45
  Top 0.305: R45.1 14.11,73.71 14.11,74.4 15.14,75.43 15.14,76.46 16.17,77.48 16.85,77.48 17.88,76.46 17.88,68.91 20.28,66.51 20.28,62.05 19.6,61.37 5.88,61.37 1.42,65.83 CV6B.1
N$46
  Top 0.305: 33.31,49.71 34.34,50.74 C25.1 | 33.31,49.71 31.94,48.34 R50.1 | R53.2 24.4,53.48 26.45,53.48 R52.2 26.8,53.48 | 26.8,53.48 29.2,53.48 R51.2 29.54,53.48 33.31,49.71 | 26.8,53.48 26.8,55.54 IC5.13
N$47
  Top 0.305: 6_SD_CLK.1 25.43,1.36 25.43,11.31 U1.7
N$48
  Top 0.305: R51.1 29.2,45.94 28.17,45.94 27.14,46.97 26.11,46.97 25.43,46.28 25.43,45.25 24.74,44.57 12.39,44.57 5.88,51.08 5.88,53.83 1.42,58.28 CV8A.1
N$49
  Top 0.305: R52.1 26.45,45.6 26.45,45.25 25.08,43.88 12.05,43.88 5.2,50.74 5.2,52.45 2.11,55.54 1.42,55.54 CV8B.1
N$50
  Top 0.305: R48.1 13.77,45.94 12.05,45.94 6.57,51.43 6.57,55.54 1.42,60.68 CV7B.1
N$51
  Top 0.305: R47.1 16.85,45.94 16.85,49.37 20.28,52.8 20.28,57.25 16.85,60.68 4.17,60.68 1.42,63.43 CV7A.1
N$52
  Top 0.305: 10,49.71 11.37,48.34 R46.1 | 10,49.71 8.97,50.74 C24.1 | 16.85,53.48 18.91,53.48 R49.2 | 16.85,53.48 16.85,55.54 IC5.9 | 16.85,53.48 R47.2 16.51,53.48 14.11,53.48 R48.2 13.77,53.48 10,49.71
N$53
  Top 0.305: 5_SD_CMD.1 23.02,1.36 23.02,10.96 U1.6
N$54
  Top 0.305: R55.1 43.26,17.48 67.95,17.48 68.63,16.79 GTIN1.1
N$55
  Top 0.305: Q1.2 31.94,14.73 35.03,14.73 35.37,15.08 R56.2 35.71,15.42 35.71,17.48 R55.2
N$56
  Top 0.305: 28.17,16.79 28.17,17.48 R57.1 | 28.17,16.79 28.17,15.42 R54.1 | 28.17,16.79 30.23,16.79 Q1.1
N$57
  Top 0.305: R63.2 55.6,39.42 55.6,40.45 54.57,41.48 54.57,45.6 55.94,46.97 68.63,46.97 CVOUT1.1
N$58
  Top 0.305: 35.71,21.25 35.71,22.62 R60.2 | 35.71,21.25 35.71,20.56 R59.2 | 35.71,21.25 31.94,21.25 Q2.2
N$59
  Top 0.305: R61.1 28.17,20.56 28.17,22.62 R58.1 28.17,22.96 30.23,22.96 Q2.1
N$60
  Top 0.305: R62.2 55.6,56.91 55.6,55.88 54.57,54.85 54.57,51.08 56.29,49.37 68.63,49.37 CVOUT2.1
N$61
  Top 0.305: 4_SD_D0.1 20.28,1.36 20.28,11.31 U1.5
N$62
  Top 0.305: 3_SD_D1.1 17.88,1.36 17.88,10.96 U1.4
N$63
  Top 0.305: 2_SD_D2.1 15.48,1.36 15.48,11.31 U1.3
N$64
  Top 0.305: 1_SD_D3.1 12.74,1.36 12.74,10.96 U1.2
N$65
  Top 0.305: 0.1 10.34,1.36 10.34,11.31 U1.1
N$66
  Top 0.305: 11.1 38.11,1.36 38.11,10.96 U1.12
N$67
  Top 0.305: 12.1 40.86,1.36 40.86,11.31 U1.13
N$69
  Top 0.305: R63.1 48.06,39.42 43.26,44.22 IC6.1 42.91,44.22 40.86,42.17 R65.2
N$70
  Top 0.305: IC6.9 55.94,51.77 57.66,50.05 59.03,50.05 60.74,51.77 R71.2 61.09,52.11 63.49,54.51 65.89,54.51 R64.1
N$71
  Top 0.305: R67.2 40.51,54.51 42.91,52.11 IC6.14 43.26,52.11 48.06,56.91 R62.1
N$72
  Top 0.305: R73.2 58.69,39.42 58.69,41.82 R66.1 58.34,41.82 55.94,44.22 IC6.6
N$73
  Top 0.305: R69.2 38.46,37.02 38.46,38.05 39.48,39.08 39.48,45.6 45.66,51.77 IC6.13 45.66,52.11 48.06,54.51 R67.1 48.4,54.85 49.43,55.88 49.43,57.94 49.09,58.28 47.71,58.28 46.69,57.25 46,57.25 R72.2
N$74
  Top 0.305: IC6.7 58.69,44.57 60.74,44.57 R71.1 61.09,44.22 63.15,42.17 65.89,42.17 R66.2
N$75
  Top 0.305: IC6.8 58.69,52.11 58.69,54.51 R64.2 58.69,54.85 58.69,56.91 R70.1
N$76
  Top 0.305: IC6.2 46,44.22 48.06,42.17 R65.1 48.4,41.82 48.4,41.14 49.43,40.11 49.43,38.74 48.74,38.05 47.03,38.05 46,39.08 R29.2 45.66,39.08 42.23,35.65 37.43,35.65 36.4,36.68 35.71,36.68 R68.2
N$78
  Top 0.305: GTOUT.1 68.63,53.83 66.23,56.23 66.23,56.91 R70.2
PE
  Top 0.305: C26.1 21.65,71.31 21.65,86.06 IC4.11 | IC4.5 19.25,93.94 19.25,86.4 IC4.10 | IC6.10 53.54,51.77 53.54,44.57 IC6.5 | Q2.3 33.31,22.96 34,22.96 35.03,23.99 41.89,23.99 42.91,22.96 R60.1 | IC7.1 24.05,33.25 19.25,33.25 C29.+ | C3.- 13.08,38.4 18.91,38.4 C6.1 19.25,38.05 20.62,36.68 24.4,36.68 27.14,39.42 29.88,39.42 IC8.2
  pour Bottom: 69.9,-0.01 0.05,-0.01 0.05,105.4 69.9,105.4

### Text on the board
tNames: Rob Ellis 2020